# Altium schematic sheet Ethernet.SchDoc: Ethernet
size A4; DocumentNumber: MB1219; Revision: B.1; SheetNumber: 7; SheetTotal: 17; Project: STM32F769I-EVAL
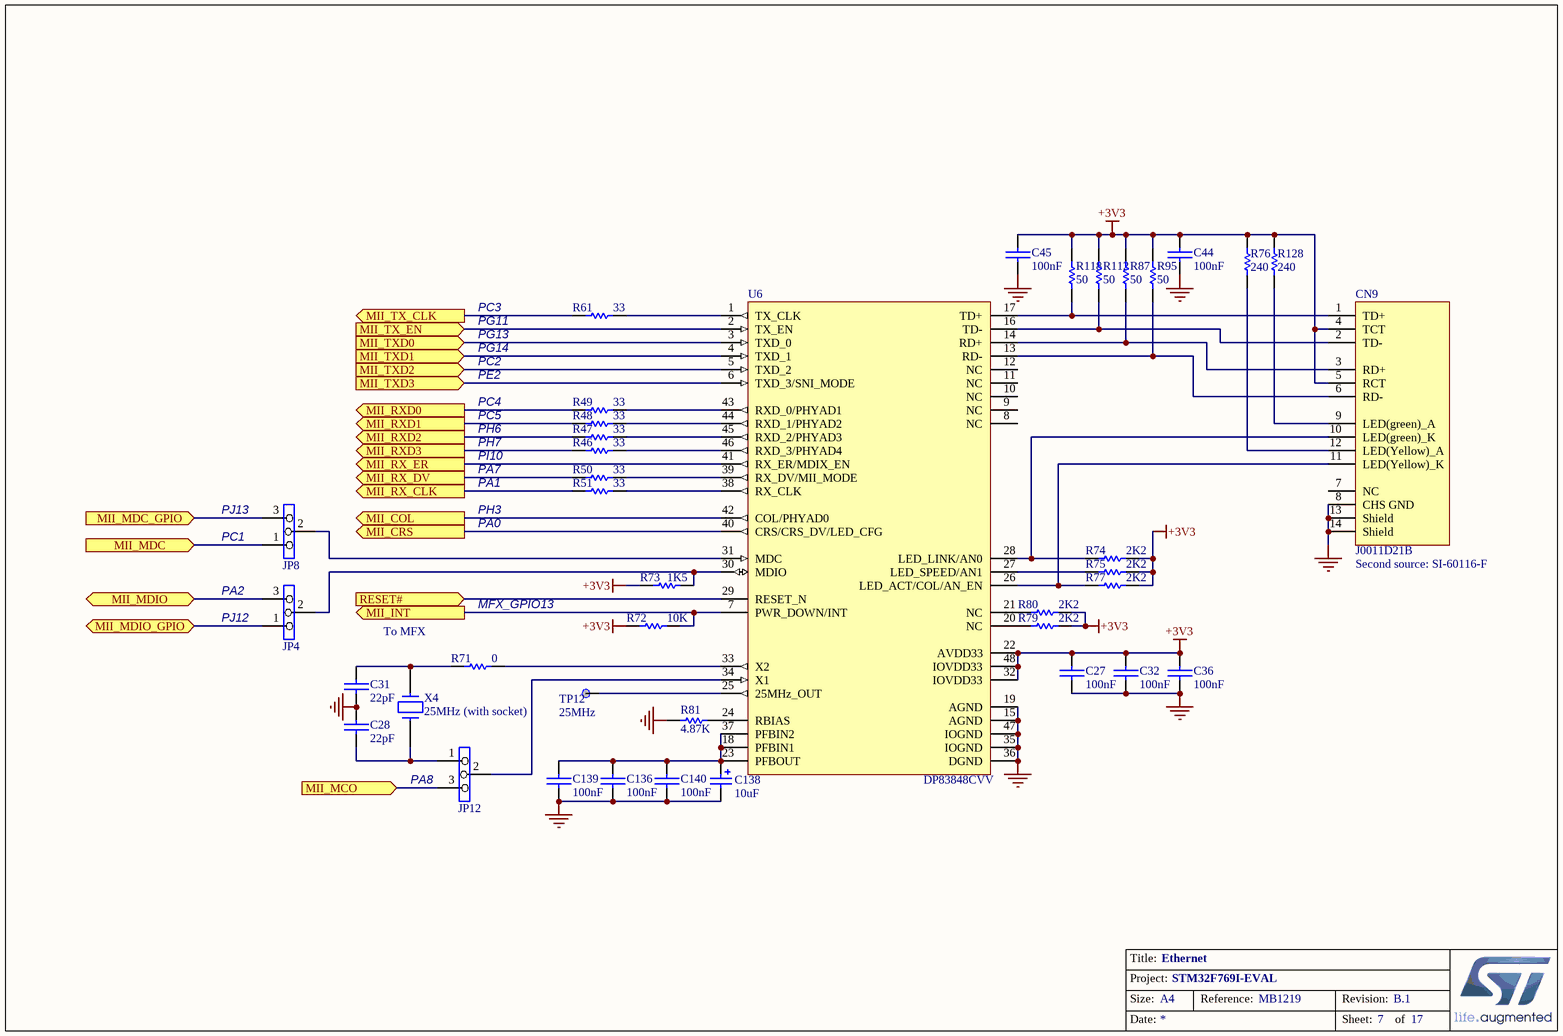
[diagram p0: Ethernet.SchDoc]

## Parts
C27  100nF  [0603C]
C28  22pF  [0603C]
C31  22pF  [0603C]
C32  100nF  [0603C]
C36  100nF  [0603C]
C44  100nF  [0603C]
C45  100nF  [0603C]
C136  100nF  [0603C]
C138  10uF  [TAN-A]
C139  100nF  [0603C]
C140  100nF  [0603C]
CN9  J0011D21B  [RJ45_J0011D01BNL]
JP4  (no value)  [SIP3]
JP8  (no value)  [SIP3]
JP12  (no value)  [SIP3]
R46  33  [0603R]
R47  33  [0603R]
R48  33  [0603R]
R49  33  [0603R]
R50  33  [0603R]
R51  33  [0603R]
R61  33  [0603R]
R71  0  [0603R]
R72  10K  [0603R]
R73  1K5  [0603R]
R74  2K2  [0603R]
R75  2K2  [0603R]
R76  240  [0603R]
R77  2K2  [0603R]
R79  2K2  [0603R]
R80  2K2  [0603R]
R81  4.87K  [0603R]
R87  50  [0603R]
R95  50  [0603R]
R112  50  [0603R]
R118  50  [0603R]
R128  240  [0603R]
TP12  25MHz  [TP]
U6  DP83848CVV  [LQFP48_0R5_9X9]
X4  25MHz (with socket)  [XTAL_socket]

## Ports
MII_COL (out), MII_CRS (out), MII_INT (out), MII_MCO (in), MII_MDC (in), MII_MDC_GPIO (in), MII_MDIO (bidir), MII_MDIO_GPIO (bidir), MII_RX_CLK (out), MII_RX_DV (out), MII_RX_ER (out), MII_RXD0 (out), MII_RXD1 (out), MII_RXD2 (out), MII_RXD3 (out), MII_TX_CLK (out), MII_TX_EN (in), MII_TXD0 (in), MII_TXD1 (in), MII_TXD2 (in), MII_TXD3 (in), RESET# (in)

## Nets
+3V3: C27.1 C32.2 C36.2 C44.2 C45.2 CN9.4(TCT) CN9.5(RCT) R72.1 R73.2 R74.2 R75.2 R76.2 R77.2 R79.2 R80.2 R87.1 R95.1 R112.1 R118.1 R128.2 U6.22(AVDD33) U6.32(IOVDD33) U6.48(IOVDD33)
GND: C27.2 C28.2 C31.1 C32.1 C36.1 C44.1 C45.1 C136.1 C138.2 C139.2 C140.1 CN9.8(CHS_GND) CN9.13(Shield) CN9.14(Shield) R81.1 U6.15(AGND) U6.19(AGND) U6.35(IOGND) U6.36(DGND) U6.47(IOGND)
MII_COL: U6.42(COL/PHYAD0) ; port MII_COL
MII_CRS: U6.40(CRS/CRS_DV/LED_CFG) ; port MII_CRS
MII_INT: R72.2 U6.7(PWR_DOWN/INT) ; port MII_INT
MII_MCO: JP12.3 ; port MII_MCO
MII_MDC: JP8.1 ; port MII_MDC
MII_MDC_GPIO: JP8.3 ; port MII_MDC_GPIO
MII_MDIO: JP4.3 ; port MII_MDIO
MII_MDIO_GPIO: JP4.1 ; port MII_MDIO_GPIO
MII_RX_CLK: R51.2 ; port MII_RX_CLK
MII_RX_DV: R50.2 ; port MII_RX_DV
MII_RX_ER: U6.41(RX_ER/MDIX_EN) ; port MII_RX_ER
MII_RXD0: R49.2 ; port MII_RXD0
MII_RXD1: R48.2 ; port MII_RXD1
MII_RXD2: R47.2 ; port MII_RXD2
MII_RXD3: R46.2 ; port MII_RXD3
MII_TX_CLK: R61.2 ; port MII_TX_CLK
MII_TX_EN: U6.2(TX_EN) ; port MII_TX_EN
MII_TXD0: U6.3(TXD_0) ; port MII_TXD0
MII_TXD1: U6.4(TXD_1) ; port MII_TXD1
MII_TXD2: U6.5(TXD_2) ; port MII_TXD2
MII_TXD3: U6.6(TXD_3/SNI_MODE) ; port MII_TXD3
RESET#: U6.29(RESET_N) ; port RESET#
NetC28_1: C28.1 JP12.1 X4.1
NetC31_2: C31.2 R71.2 X4.2
NetC136_2: C136.2 C138.1 C139.1 C140.2 U6.18(PFBIN1) U6.23(PFBOUT) U6.37(PFBIN2)
NetCN9_1: CN9.1(TD+) R118.2 U6.17(TD+)
NetCN9_2: CN9.2(TD-) R112.2 U6.16(TD-)
NetCN9_3: CN9.3(RD+) R87.2 U6.14(RD+)
NetCN9_6: CN9.6(RD-) R95.2 U6.13(RD-)
NetCN9_9: CN9.9(LED(green)_A) R128.1
NetCN9_10: CN9.10(LED(green)_K) R74.1 U6.28(LED_LINK/AN0)
NetCN9_11: CN9.11(LED(Yellow)_K) R77.1 U6.26(LED_ACT/COL/AN_EN)
NetCN9_12: CN9.12(LED(Yellow)_A) R76.1
NetJP4_2: JP4.2 R73.1 U6.30(MDIO)
NetJP8_2: JP8.2 U6.31(MDC)
NetJP12_2: JP12.2 U6.34(X1)
NetR46_1: R46.1 U6.46(RXD_3/PHYAD4)
NetR47_1: R47.1 U6.45(RXD_2/PHYAD3)
NetR48_1: R48.1 U6.44(RXD_1/PHYAD2)
NetR49_1: R49.1 U6.43(RXD_0/PHYAD1)
NetR50_1: R50.1 U6.39(RX_DV/MII_MODE)
NetR51_1: R51.1 U6.38(RX_CLK)
NetR61_1: R61.1 U6.1(TX_CLK)
NetR71_1: R71.1 U6.33(X2)
NetR75_1: R75.1 U6.27(LED_SPEED/AN1)
NetR79_1: R79.1 U6.20(NC)
NetR80_1: R80.1 U6.21(NC)
NetR81_2: R81.2 U6.24(RBIAS)
NetTP12_1: TP12.1 U6.25(25MHz_OUT)

Not connected (* = marked no-connect by the designer): CN9 7(NC); U6 8(NC) 9(NC) 10(NC) 11(NC) 12(NC)

## Notes on the sheet
- PC3
- PG11
- PG13
- PG14
- PC2
- PE2
- PC4
- PC5
- PH6
- PH7
- (near JP8) PJ13
- PI10
- PA7
- PH3
- PA1
- PC1
- PA0
- (near CN9) Second source: SI-60116-F
- PA2
- (near JP4) PJ12
- To MFX
- MFX_GPIO13
- (near JP12) PA8
- Title:
- Project:
- Size:
- Date:
- A4
- Reference:
- Sheet:
- Revision:
- of

## Library data of the parts
C27 C28 C31 C32 C36 C44 C45 C136 C139 C140 = CAP: Capacitor
C138 = Cap Pol1: Polarized Capacitor (Radial); Published: 8-Jun-2000; Revision: July-2002: Re-released for DXP Platform.; Publisher: Altium Limited; Value: 10uF
JP4 JP8 JP12 = Jumper3
R46-R51 R61 R71-R77 R79-R81 R87 R95 R112 R118 R128 = Res1: Resistor; Value: 1K; Published: 8-Jun-2000; Revision: July-2002: Re-released for DXP Platform.; Publisher: Altium Limited
TP12 = TP
X4 = CRYSTAL